# Altium schematic sheet Tracker_test.SchDoc
size A; SheetNumber: 1; SheetTotal: 5
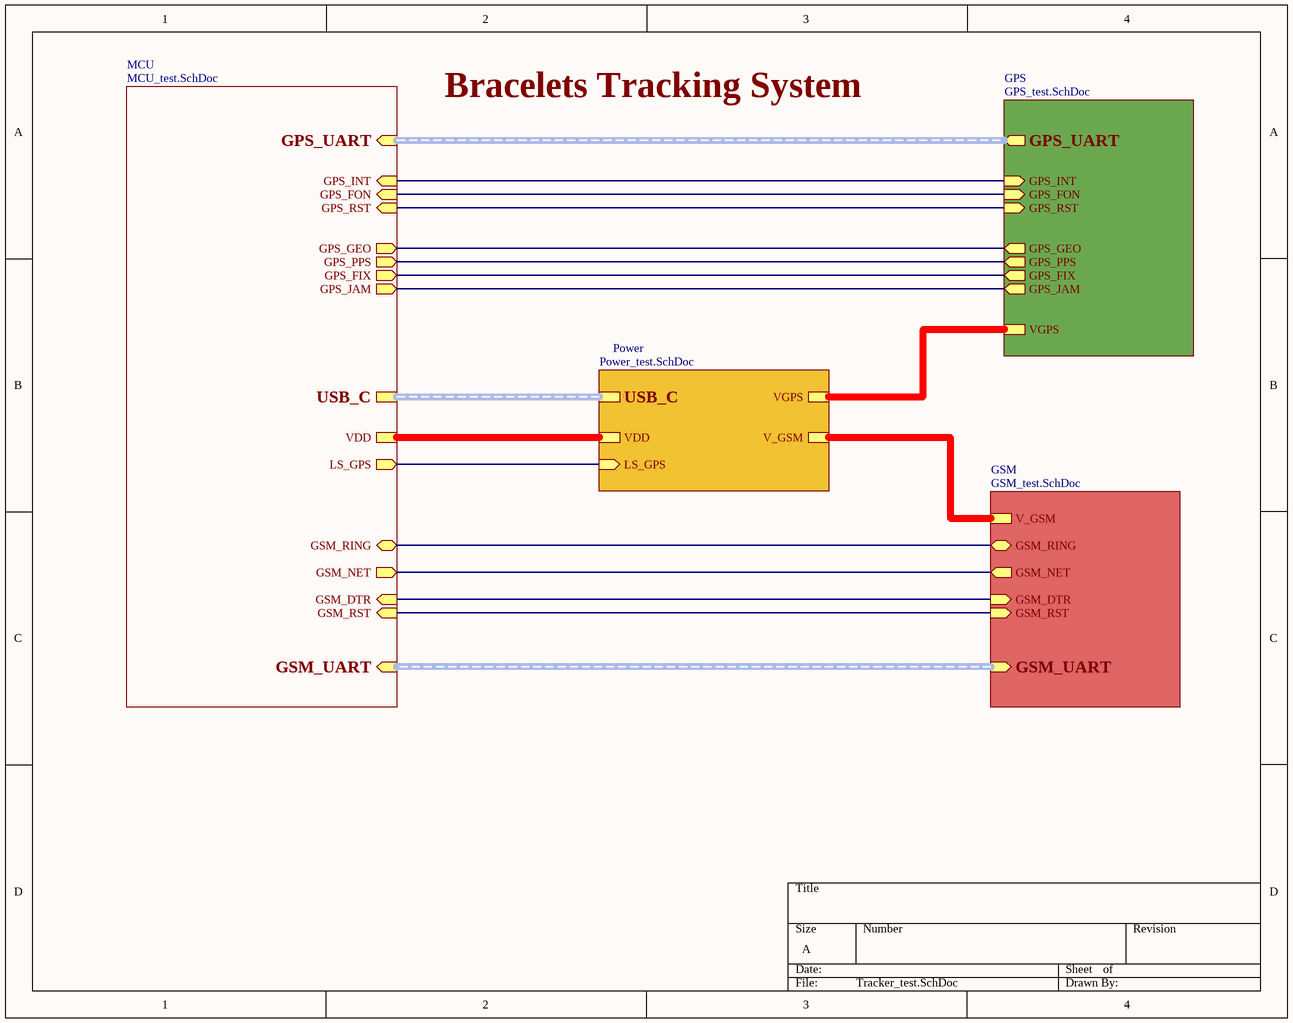
[diagram p0: Tracker_test.SchDoc]

## Sub-sheets
GPS = GPS_test.SchDoc: VGPS, GPS_INT (in), GPS_RST (in), GPS_FON (in), GPS_PPS (out), GPS_JAM (out), GPS_FIX (out), GPS_GEO (out), GPS_UART (out, harness GPS_UART)
GSM = GSM_test.SchDoc: GSM_RING (bidir), GSM_DTR (in), GSM_NET (out), GSM_RST (in), GSM_UART (in, harness GSM_UART), V_GSM
MCU = MCU_test.SchDoc: GPS_UART (in, harness GPS_UART), GPS_INT (in), GPS_RST (in), GPS_FON (in), GPS_PPS (out), GPS_JAM (out), GPS_FIX (out), GPS_GEO (out), VDD, LS_GPS (out), GSM_RING (bidir), GSM_DTR (in), GSM_NET (out), GSM_RST (in), GSM_UART (in, harness GSM_UART), USB_C
Power = Power_test.SchDoc: VDD, VGPS, V_GSM, LS_GPS (in), USB_C

## Nets
(unnamed): sheet GPS/VGPS, sheet Power/VGPS
(unnamed): sheet GPS/GPS_INT, sheet MCU/GPS_INT
(unnamed): sheet GPS/GPS_RST, sheet MCU/GPS_RST
(unnamed): sheet GPS/GPS_FON, sheet MCU/GPS_FON
(unnamed): sheet GPS/GPS_PPS, sheet MCU/GPS_PPS
(unnamed): sheet GPS/GPS_JAM, sheet MCU/GPS_JAM
(unnamed): sheet GPS/GPS_FIX, sheet MCU/GPS_FIX
(unnamed): sheet GPS/GPS_GEO, sheet MCU/GPS_GEO
(unnamed): sheet Power/VDD, sheet MCU/VDD
(unnamed): sheet Power/V_GSM, sheet GSM/V_GSM
(unnamed): sheet Power/LS_GPS, sheet MCU/LS_GPS
(unnamed): sheet MCU/GSM_RING, sheet GSM/GSM_RING
(unnamed): sheet MCU/GSM_DTR, sheet GSM/GSM_DTR
(unnamed): sheet MCU/GSM_NET, sheet GSM/GSM_NET
(unnamed): sheet MCU/GSM_RST, sheet GSM/GSM_RST

## Buses and harness runs
harness sheet GPS/GPS_UART = sheet MCU/GPS_UART
harness sheet GSM/GSM_UART = sheet MCU/GSM_UART
harness sheet MCU/USB_C = sheet Power/USB_C

## Notes on the sheet
- Bracelets Tracking System